# Altium schematic sheet USB.SchDoc
size 420 x 297 mm; Date: UNUSED; CompanyName: CMT; DrawnBy: UNUSED; Engineer: UNUSED; Organization: Curtin Motorsport Team; Address1: Rm 151 Building 206; Address2: Curtin University; Address3: Kent Street, Bently; Address4: Western Australia; DocumentNumber: UNUSED; Revision: UNUSED; SheetNumber: 5; SheetTotal: 5; Year: UNUSED; SheetSize: A3; Time: UNUSED; ImagePath: UNUSED; Application_BuildNumber: UNUSED
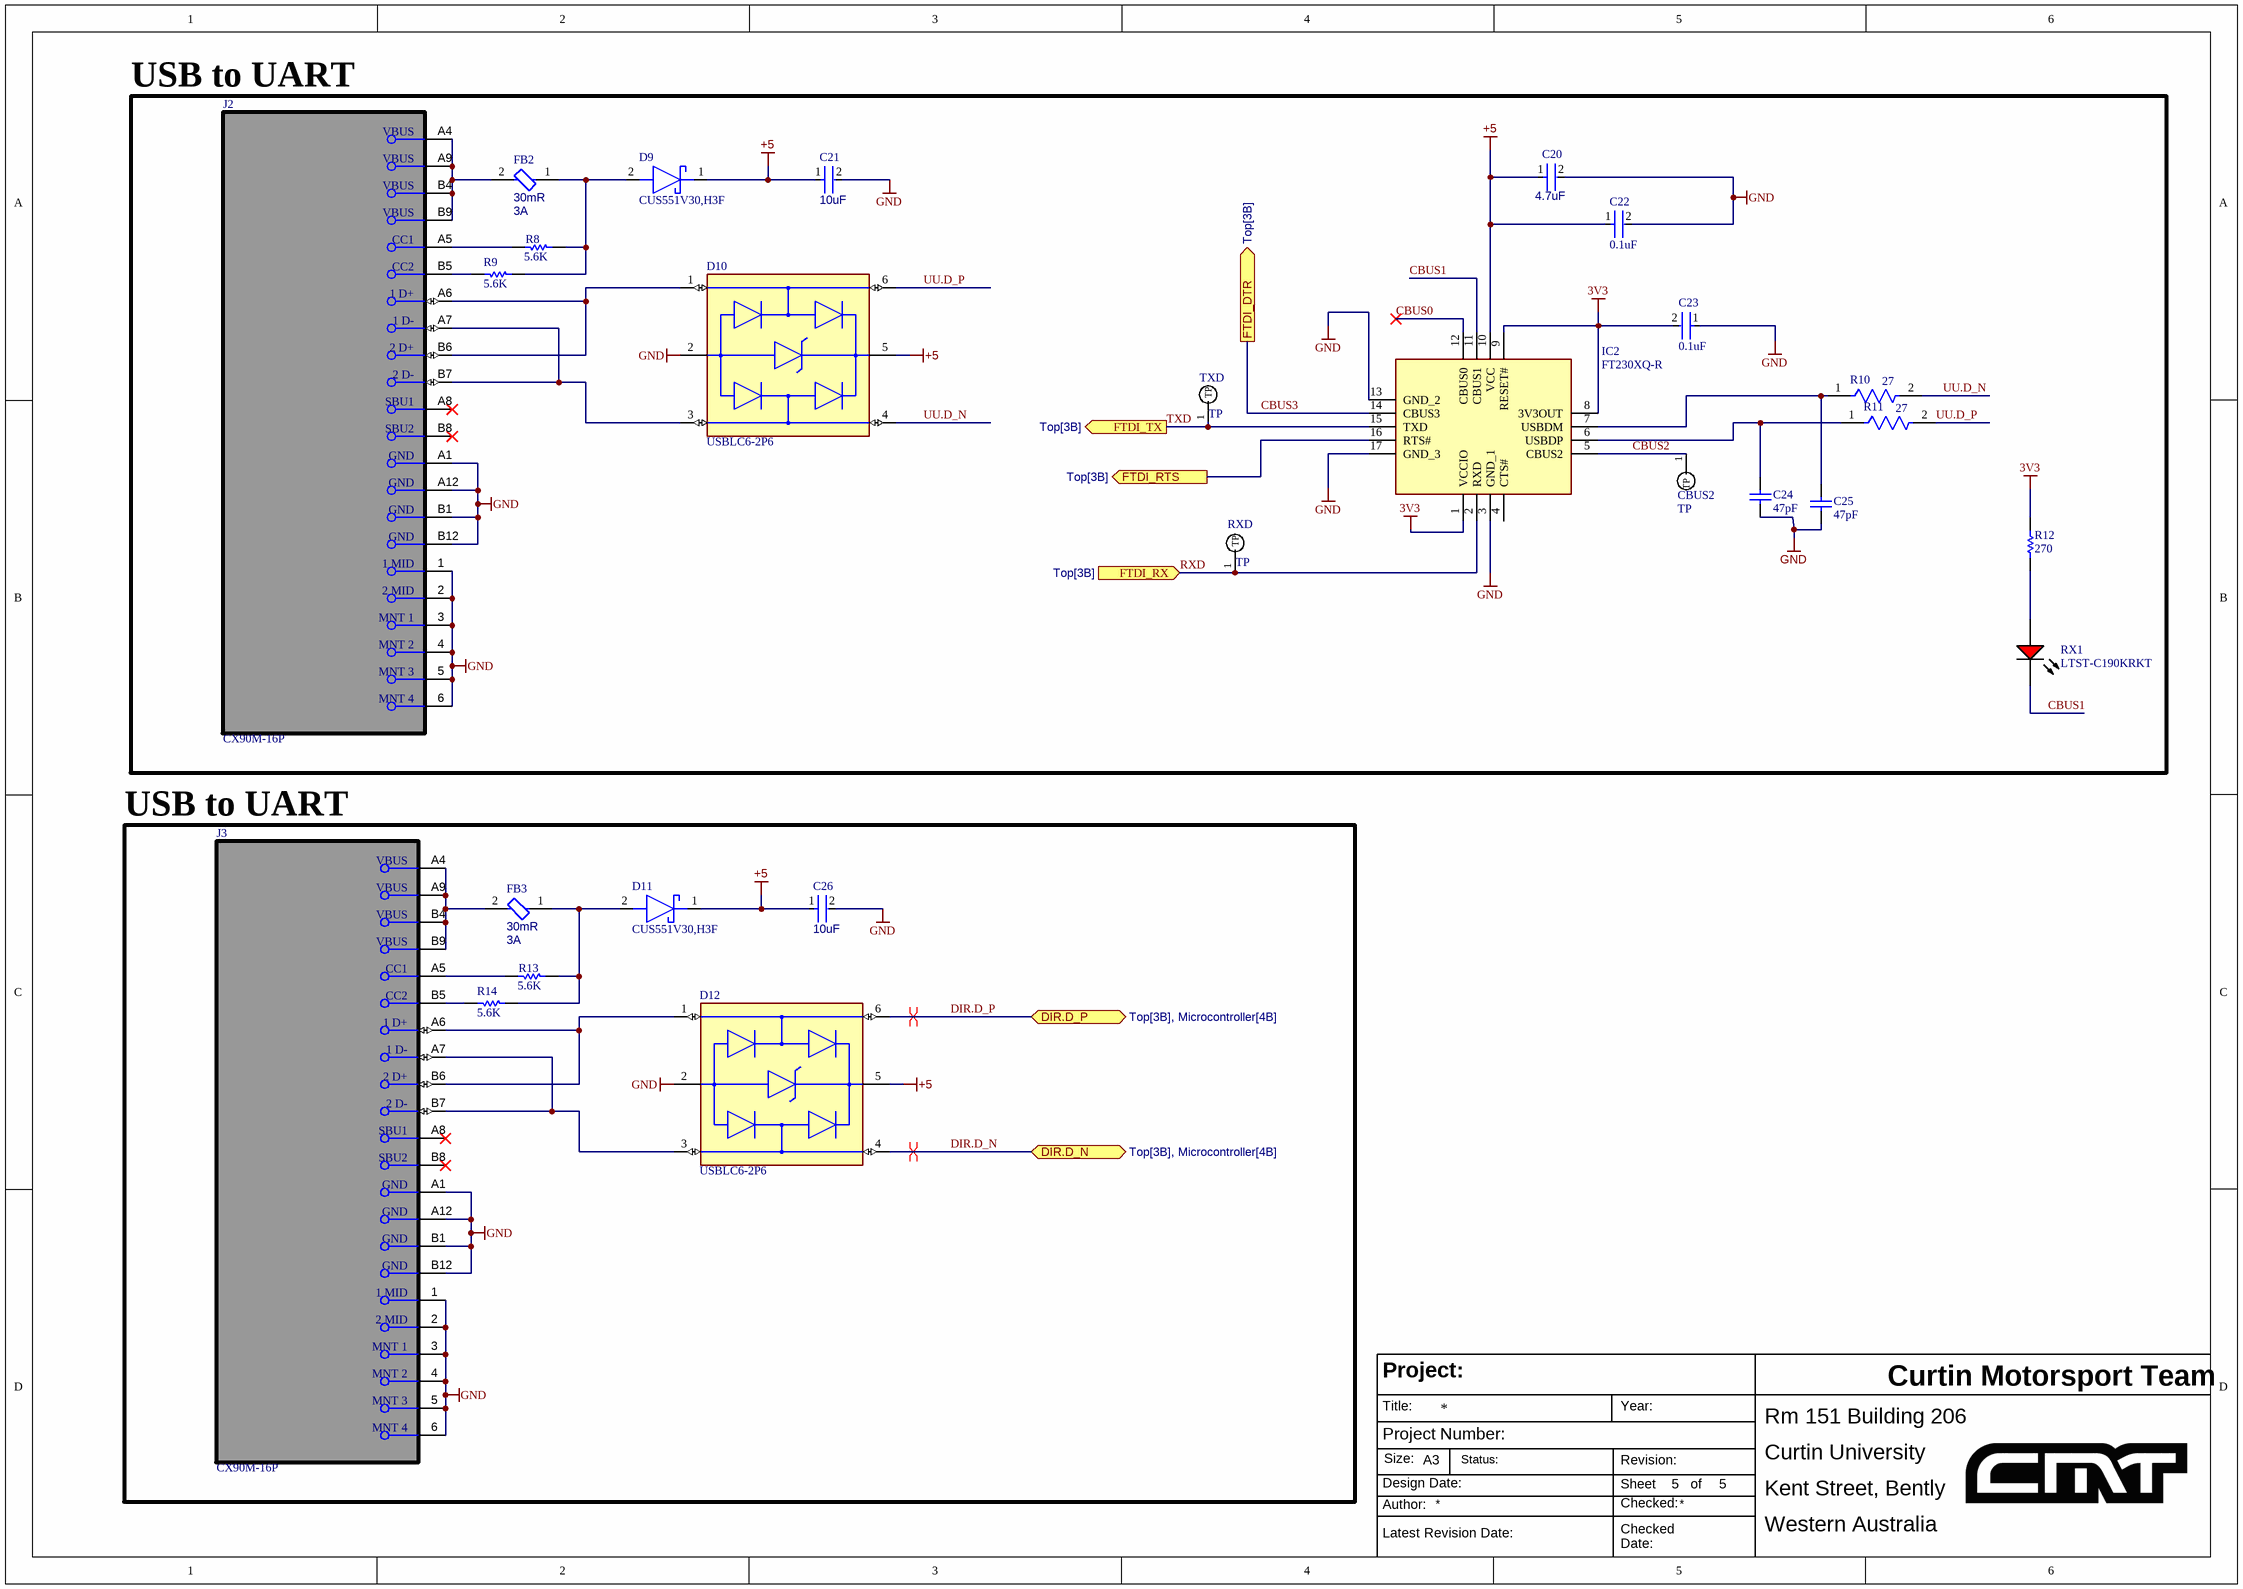
[diagram p0: USB.SchDoc]

## Parts
C20  Capacitance: 4.7uF  [FP-GRM188-0_15-IPC_C]  (hidden comment: GRM188R61E475KE11D)
C21  Capacitance: 10uF  [FP-C1608-080-IPC_A]  (hidden comment: C1608X5R1E106M080AC)
C22  0.1uF  [FP-C0603C-CF-MFG]
C23  0.1uF  [FP-C0603C-CF-MFG]
C24  47pF  [CAPC1608X90X35NL10T15]
C25  47pF  [CAPC1608X90X35NL10T15]
C26  Capacitance: 10uF  [FP-C1608-080-IPC_A]  (hidden comment: C1608X5R1E106M080AC)
CBUS2  TP  [TestPad]
D9  CUS551V30,H3F  [1SS357TPH3F]
D10  USBLC6-2P6  [FP-SOT-666-MFG]
D11  CUS551V30,H3F  [1SS357TPH3F]
D12  USBLC6-2P6  [FP-SOT-666-MFG]
FB2  DC Resistance (DCR): 30mR  Current Rating: 3A  [FP-BLM21-0_2-t0_85-e0_5-d-IPC_B]  (hidden comment: BLM21PG121SN1D)
FB3  DC Resistance (DCR): 30mR  Current Rating: 3A  [FP-BLM21-0_2-t0_85-e0_5-d-IPC_B]  (hidden comment: BLM21PG121SN1D)
IC2  FT230XQ-R  [QFN65P400X400X80-17N]
J2  CX90M-16P  [FP-CX90M-16P-MFG]
J3  CX90M-16P  [FP-CX90M-16P-MFG]
R8  5.6K  [RESC1609X50X30NL10T20]
R9  5.6K  [RESC1609X50X30NL10T20]
R10  27  [FP-ERJ3EK-IPC_B]
R11  27  [FP-ERJ3EK-IPC_B]
R12  270  [RESC1609X50X30NL10T20]
R13  5.6K  [RESC1609X50X30NL10T20]
R14  5.6K  [RESC1609X50X30NL10T20]
RX1  LTST-C190KRKT  [LTST-C191KRKT_V]
RXD  TP  [TestPad]
TXD  TP  [TestPad]

## Blocks framed on the sheet
USB to UART: C20-C25 CBUS2 D9 D10 FB2 IC2 J2 R8-R12 RX1 RXD TXD
USB to UART: C26 D11 D12 FB3 J3 R13 R14

## Ports
DIR.D_N (bidir, see Top[3B], Microcontroller[4B]), DIR.D_P (bidir, see Top[3B], Microcontroller[4B]), FTDI_DTR (out, see Top[3B]), FTDI_RTS (out, see Top[3B]), FTDI_RX (in, see Top[3B]), FTDI_TX (out, see Top[3B])

## Nets
3V3: C23.2 IC2.1(VCCIO) IC2.8(3V3OUT) IC2.9(RESET#) R12.2
+5: C20.1 C21.1 C22.1 C26.1 D9.1(K) D10.5(VBUS) D11.1(K) D12.5(VBUS) IC2.10(VCC)
GND: C20.2 C21.2 C22.2 C23.1 C24.1 C25.1 C26.2 D10.2(GND) D12.2(GND) IC2.3(GND_1) IC2.13(GND_2) IC2.17(GND_3) J2.1(1_MID) J2.2(2_MID) J2.3(MNT_1) J2.4(MNT_2) J2.5(MNT_3) J2.6(MNT_4) J2.A1(GND) J2.A12(GND) J2.B1(GND) J2.B12(GND) J3.1(1_MID) J3.2(2_MID) J3.3(MNT_1) J3.4(MNT_2) J3.5(MNT_3) J3.6(MNT_4) J3.A1(GND) J3.A12(GND) J3.B1(GND) J3.B12(GND)
CBUS0: IC2.12(CBUS0)
CBUS1: IC2.11(CBUS1) RX1.2(K)
CBUS2: CBUS2.1(TP) IC2.5(CBUS2)
CBUS3: IC2.14(CBUS3) ; port FTDI_DTR
DIR.D_N: D12.4(I/O2) ; port DIR.D_N
DIR.D_P: D12.6(I/O1) ; port DIR.D_P
FTDI_RTS: IC2.16(RTS#) ; port FTDI_RTS
RXD: IC2.2(RXD) RXD.1(TP) ; port FTDI_RX
TXD: IC2.15(TXD) TXD.1(TP) ; port FTDI_TX
UU.D_N: D10.4(I/O2) R10.2
UU.D_P: D10.6(I/O1) R11.2
NetC24_2: C24.2 IC2.6(USBDP) R11.1
NetC25_2: C25.2 IC2.7(USBDM) R10.1
NetD9_2: D9.2(A) FB2.1 R8.1 R9.2
NetD10_1: D10.1(I/O1) J2.A6(1_D+) J2.B6(2_D+)
NetD10_3: D10.3(I/O2) J2.A7(1_D-) J2.B7(2_D-)
NetD11_2: D11.2(A) FB3.1 R13.1 R14.2
NetD12_1: D12.1(I/O1) J3.A6(1_D+) J3.B6(2_D+)
NetD12_3: D12.3(I/O2) J3.A7(1_D-) J3.B7(2_D-)
NetFB2_2: FB2.2 J2.A4(VBUS) J2.A9(VBUS) J2.B4(VBUS) J2.B9(VBUS)
NetFB3_2: FB3.2 J3.A4(VBUS) J3.A9(VBUS) J3.B4(VBUS) J3.B9(VBUS)
NetJ2_A5: J2.A5(CC1) R8.2
NetJ2_B5: J2.B5(CC2) R9.1
NetJ3_A5: J3.A5(CC1) R13.2
NetJ3_B5: J3.B5(CC2) R14.1
NetR12_1: R12.1 RX1.1(A)

Not connected (* = marked no-connect by the designer): IC2 4(CTS#); J2 A8(SBU1)* B8(SBU2)*; J3 A8(SBU1)* B8(SBU2)*

## Layout directives
differential pair: DIR.D_N, DIR.D_P

## Notes on the sheet
- Project:
- Title:
- Project Number:
- Size:
- Status:
- Revision:
- Year:
- Design Date:
- Author:
- Latest Revision Date:
- Sheet
- Checked:
- Checked
- of
- Date:

## Library data of the parts
C20 = CMP-2006-02523-2: Chip Multilayer Ceramic Capacitors for General Purpose, 0603, 4.7uF, X5R, 15%, 10%, 25V; Case Code (Metric): 1608; Max Operating Temperature: 85°C; REACH SVHC: No SVHC; Voltage Rating: 25V; Dielectric: X5R; Packaging: Cut Tape; Width: 0.031inch; Min Operating Temperature: -55°C; Lead Free: Lead Free; Height: 0.8mm; Case Code (Imperial): 0603; Length: 1.6mm; Voltage Rating (DC): 25V; Case/Package: 0603; Voltage: 25V; Tolerance: 10%; Thickness: 0.031inch; Mount: Surface Mount; Material: Ceramic; Package Quantity: 4000; Depth: 0.8mm
C21 C26 = CMP-2000-05442-2: CAP CER 10UF 25V X5R 0603; Dielectric Material: Ceramic; Tolerance: 20%; Dielectric: X5R; Length: 1.6mm; Termination: SMD/SMT; Depth: 0.8mm; RoHS Compliant: Yes; Construction: Flat; Weight: 7.1E-05oz; Thickness: 0.039inch; Packaging: Tape and Reel; Min Operating Temperature: -55°C; Case Code (Imperial): 0603; Case/Package: 0603; Height: 0.8mm; Case Code (Metric): 1608; Voltage Rating: 25V; Resistor Type: Ceramic; Voltage Rating (DC): 25V; Max Operating Temperature: 85°C; REACH SVHC: No SVHC; Lead Free: Lead Free; Series: C; Width: 0.8mm; Mount: Surface Mount; Package Quantity: 1
C22 C23 = CMP-2006-03061-2: CAP CER 0.1UF 50V X7R 0603; Manufacturer: KEMET; Manufacturer Part Number: C0603C104K5RACTU; Tolerance: 0.1; Temperature Coefficient: 30ppm/°C; Material: Ceramic; Automotive Grade: Grade 1; Value: 0.10 μF; Temperature: -55°C to +125°C; RoHS: TRUE; Temperature Range High: +125°C; Lead Free: Yes; Octopart: https://octopart.com/c0603c104k5ractu-kemet-139244; Digikey Description: CAP CER 0.1UF 50V X7R 0603; Category: Cap; Package: C0603C-CF; ComponentLink2Description: Datasheet; Temperature Range Low: -55°C; Device Class L1: Passive Components; Voltage Rating: 50 V; Automotive: Yes; Device Class L3: Ceramic Capacitors; ComponentLink2URL: https://api.kemet.com/component-edge/download/datasheet/C0603C100J5GACAUTO.pdf; Capacitance: 0.10 μF; Device Class L2: Capacitors; Temperature Characteristic: X7R; Height: 0.87mm
C24 C25 = CMP-2006-02672-1: Manufacturer: Murata; Part Number: GRM1885C1H470JA01D
CBUS2 RXD TXD = Test Points
D9 D11 = CMP-020-000009-1: Schottky Diode; Manufacturer_Name: Toshiba; Mouser Part Number: 757-CUS551V30H3F; Arrow Price/Stock: https://www.arrow.com/en/products/cus551v30h3f/toshiba; Mouser Price/Stock: https://www.mouser.co.uk/ProductDetail/Toshiba/CUS551V30H3F?qs=%252B8yZ8wZTKG7VmjE5ZJgf8Q%3D%3D; Manufacturer_Part_Number: CUS551V30,H3F; Source: SamacSys.SchLib; Datasheet Link: http://toshiba.semicon-storage.com/info/docget.jsp?did=10394&prodName=CUS551V30; Arrow Part Number: CUS551V30,H3F; Height: 1mm; Design Item ID: CUS551V30,H3F
D10 D12 = CMP-12225-000058-1: TVS DIODE 5.25V 17V SOT666; Min Breakdown Voltage: 6V; Power Line Protection: Yes; Element Configuration: Dual; Test Current: 1mA; Working Voltage: 5V; Number of Channels: 2; Max Reverse Leakage Current: 150nA; Direction: Unidirectional; Peak Pulse Current: 5A; Number of Elements: 1; Capacitance: 3.5pF; Max Breakdown Voltage: 6V; Height: 0.6mm; Depth: 1.3mm; Contact Plating: Tin; Reverse Breakdown Voltage: 6V; REACH SVHC: No SVHC; Operating Supply Voltage: 5V; Width: 1.3mm; Max Operating Temperature: 125°C; Reverse Standoff Voltage: 5V; ESD Protection: Yes; Package Quantity: 1; Termination: SMD/SMT; Length: 1.7mm; Leakage Current: 150nA; Number of Bidirectional Channels: 2; Case/Package: SOT-666; Min Operating Temperature: -40°C; Number of Pins: 6; Clamping Voltage: 17V; Breakdown Voltage: 6V; Lead Free: Lead Free; Radiation Hardening: No; Packaging: Tape and Reel; Mount: Surface Mount; Polarity: Unidirectional
FB2 FB3 = CMP-00002-2: Ferrite Beads Multi-Layer 120Ohm 25% 100MHz 3A 30mOhm DCR 0805 Paper T/R; Manufacturer_Name: Murata; Material: Steel,Ferrite; Impedance: 120R; Case/Package: 0805; Case Code (Imperial): 0805; Min Operating Temperature: -55°C; Max Operating Temperature: 125°C; Manufacturer_Part_Number: BLM21PG121SN1D
IC2 = CMP-009-000001-1: Integrated Circuit; Manufacturer_Name: FTDI Chip; Mouser Price/Stock: https://www.mouser.co.uk/ProductDetail/FTDI/FT230XQ-R?qs=Gp1Yz1mis3VvmXwyDmIHOg%3D%3D; Height: 0.8mm; Mouser Part Number: 895-FT230XQ-R; Source: SamacSys.SchLib; Design Item ID: FT230XQ-R; Datasheet Link: https://componentsearchengine.com/Datasheets/1/FT230XQ-R.pdf; Manufacturer_Part_Number: FT230XQ-R
J2 J3 = CMP-002-00177-2: USB Connector, USB Type C, USB 2.0, Receptacle, 16 Ways, Surface Mount, Right Angle; Manufacturer_Name: Hirose; Mating Cycles: 10000; Shielding: Shielded; Number of Ports: 1; Voltage Rating: 20V; Flammability Rating: UL94 V-0; RoHS Compliant: Yes; Packaging: Cut Tape; Pins: 16; Insulation Color: Black; Contact Plating: Gold; Gender: Receptacle; Height: 1.7mm; Termination: Solder; Contact Material: Nickel,Gold; Connector Type: USB; Series: CX; Max Operating Temperature: 85°C; Min Operating Temperature: -30°C; Mounting Technology: Surface Mount,Through Hole,Edge,Board,Horizontal; Manufacturer_Part_Number: CX90M-16P
R8 R9 R12-R14 = CMP-1012-00708-2: Part Number: CRCW060356K0FKEA; Manufacturer: Vishay Dale
R10 R11 = CMP-2000-00396-2: RES SMD 27 OHM 1% 1/10W 0603; Max Power Dissipation: 100mW; Resistance: 27R; Voltage Rating: 75V; Temperature Coefficient: 100ppm/°C; Number of Pins: 2; Case Code (Imperial): 0603; Resistance Tolerance: 1%; Max Operating Temperature: 155°C; Min Operating Temperature: -55°C; Termination: SMD/SMT; Length: 1.6mm; Resistor Type: Thick Film; Tolerance: 1%; Packaging: Tape and Reel; Radiation Hardening: No; Series: ERJ; Depth: 0.8mm; RoHS Compliant: Yes; Lead Free: Lead Free; Height: 0.022inch; Width: 0.031inch; Mount: Surface Mount; Contact Plating: Tin; Number of Terminations: 2; Features: Automotive AEC-Q200; Military Standard: Not; Power Rating: 100mW; Package Quantity: 1; Case/Package: 0603; Construction: Rectangular; Voltage Rating (DC): 75V; Case Code (Metric): 1608
RX1 = CMP-007-00024-3: LED Uni-Color Red, 62.5 mW, 25 mA, -30 to 85 degC, 2-Pin SMD, RoHS, Tape and Reel; Manufacturer: Lite-On; Manufacturer_Name: Vishay; Power: 75mW; Forward Voltage: 2V; Luminous Intensity: 54mcd; Lens Style: Diffused; Viewing Angle: 130degrees; Forward Current: 20mA; Manufacturer URL: http://www.us.liteon.com/; Case/Package: 0603; Datasheet Version: Rev. F, 05/2013; Package Reference: C191KRKT; Datasheet URL: http://optoelectronics.liteon.com/upload/download/DS-22-99-0151/S_110_LTST-C190KRKT.pdf; Package Description: 2-Pin Surface Mount Device, Body 1.6 x 0.8 mm; Nominal Vf: 2V; Packaging: TapeandReel; RoHS Compliant: True; Pins: 2; Illumination Colour: Red; Colour: Red; Mounting Technology: SM; Package Quantity: 3000; Min Operating Temperature: -55°C; Max Operating Temperature: 85°C; Manufacturer_Part_Number: LTST-C190KRKT